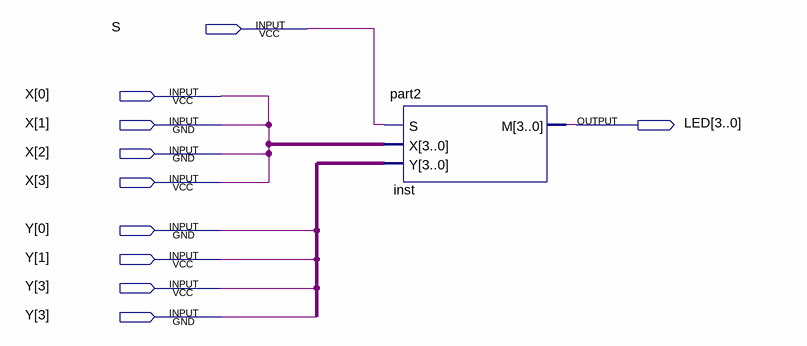
[diagram p0: schematic sheet]
// Quartus schematic part2.bdf as structural Verilog: 1 symbols, 10 pins
module part2 (
  input  S,
  input  [3:0] X,
  input  [3:0] Y,
  output [3:0] LED
);

  wire [3:0] undriven, undriven_2;

  part2 inst (.S(S), .X(undriven), .Y(undriven_2), .M(LED));

  assign {X[2], X[0]} = {X[3], X[1]};
endmodule
